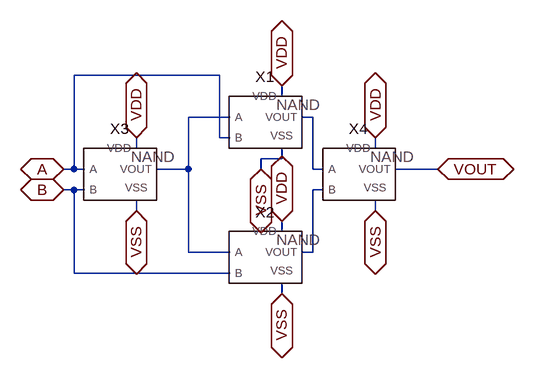
[diagram p0: schematic FOUR_NAND.asc]
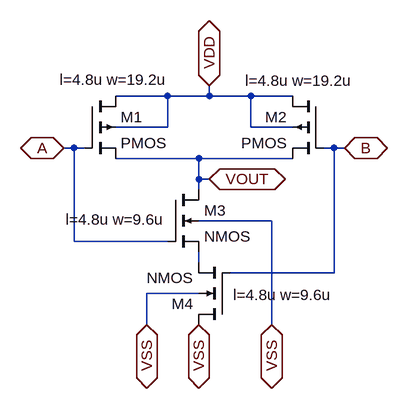
[diagram p1: sub-circuit nand.asc]
FOUR_NAND.asc, the LTspice schematic file:
Version 4
SHEET 1 880 680
WIRE -16 16 -240 16
WIRE 80 48 80 32
WIRE 0 80 -64 80
WIRE 128 80 112 80
WIRE -16 112 -16 16
WIRE 0 112 -16 112
WIRE -144 128 -144 112
WIRE 224 128 224 112
WIRE 80 144 80 128
WIRE 80 144 48 144
WIRE -240 160 -240 16
WIRE -240 160 -256 160
WIRE -224 160 -240 160
WIRE -64 160 -64 80
WIRE -64 160 -112 160
WIRE 48 160 48 144
WIRE 128 160 128 80
WIRE 144 160 128 160
WIRE 320 160 256 160
WIRE -240 192 -256 192
WIRE -224 192 -240 192
WIRE 144 192 128 192
WIRE -144 224 -144 208
WIRE 224 224 224 208
WIRE 80 256 80 240
WIRE -64 288 -64 160
WIRE 0 288 -64 288
WIRE 128 288 128 192
WIRE 128 288 112 288
WIRE -240 320 -240 192
WIRE 0 320 -240 320
WIRE 80 352 80 336
FLAG 80 32 VDD
IOPIN 80 32 BiDir
FLAG 80 240 VDD
IOPIN 80 240 BiDir
FLAG -144 112 VDD
IOPIN -144 112 BiDir
FLAG 224 112 VDD
IOPIN 224 112 BiDir
FLAG -256 160 A
IOPIN -256 160 BiDir
FLAG -256 192 B
IOPIN -256 192 BiDir
FLAG 320 160 VOUT
IOPIN 320 160 BiDir
FLAG -144 224 VSS
IOPIN -144 224 BiDir
FLAG 48 160 VSS
IOPIN 48 160 BiDir
FLAG 80 352 VSS
IOPIN 80 352 BiDir
FLAG 224 224 VSS
IOPIN 224 224 BiDir
SYMBOL nand 48 96 R0
SYMATTR InstName X1
SYMBOL nand 48 304 R0
SYMATTR InstName X2
SYMBOL nand -176 176 R0
SYMATTR InstName X3
SYMBOL nand 192 176 R0
SYMATTR InstName X4

nand.asc, the sub-circuit schematic file:
Version 4
SHEET 1 880 680
WIRE 208 32 128 32
WIRE 272 32 272 16
WIRE 272 32 208 32
WIRE 336 32 272 32
WIRE 400 32 336 32
WIRE 208 80 208 32
WIRE 208 80 128 80
WIRE 336 80 336 32
WIRE 400 80 336 80
WIRE 64 112 48 112
WIRE 80 112 64 112
WIRE 464 112 448 112
WIRE 480 112 464 112
WIRE 256 128 128 128
WIRE 400 128 256 128
WIRE 256 160 256 128
WIRE 272 160 256 160
WIRE 256 176 256 160
WIRE 368 224 256 224
WIRE 64 256 64 112
WIRE 208 256 64 256
WIRE 256 288 256 272
WIRE 464 304 464 112
WIRE 464 304 304 304
WIRE 256 336 176 336
WIRE 176 384 176 336
WIRE 368 384 368 224
FLAG 256 384 VSS
IOPIN 256 384 BiDir
FLAG 48 112 A
IOPIN 48 112 BiDir
FLAG 480 112 B
IOPIN 480 112 BiDir
FLAG 176 384 VSS
IOPIN 176 384 BiDir
FLAG 272 16 VDD
IOPIN 272 16 BiDir
FLAG 368 384 VSS
IOPIN 368 384 BiDir
FLAG 272 160 VOUT
IOPIN 272 160 BiDir
SYMBOL pmos4 80 32 R0
WINDOW 123 -38 -25 Left 2
SYMATTR Value2 l=4.8u w=19.2u
SYMATTR InstName M1
SYMBOL pmos4 448 32 M0
WINDOW 123 -45 -24 Left 2
SYMATTR Value2 l=4.8u w=19.2u
SYMATTR InstName M2
SYMBOL nmos4 208 176 R0
WINDOW 123 -157 46 Left 2
SYMATTR Value2 l=4.8u w=9.6u
SYMATTR InstName M3
SYMBOL nmos4 304 384 R180
WINDOW 123 -157 46 Left 2
SYMATTR Value2 l=4.8u w=9.6u
SYMATTR InstName M4

The netlist it stands for:
* FOUR_NAND.asc
XX1 N001 A VDD N002 VSS nand
XX2 N001 B VDD N003 VSS nand
XX3 A B VDD N001 VSS nand
XX4 N002 N003 VDD VOUT VSS nand

* block symbol definitions
.subckt nand A B VDD VOUT VSS
M1 VDD A VOUT VDD PMOS l=4.8u w=19.2u
M2 VDD B VOUT VDD PMOS l=4.8u w=19.2u
M3 VOUT A N001 VSS NMOS l=4.8u w=9.6u
M4 VSS B N001 VSS NMOS l=4.8u w=9.6u
.ends nand

.model NMOS NMOS
.model PMOS PMOS
.lib standard.mos
.backanno
.end